# Altium schematic sheet HV_Detection.SchDoc
size A4; SheetNumber: 5; SheetTotal: 6
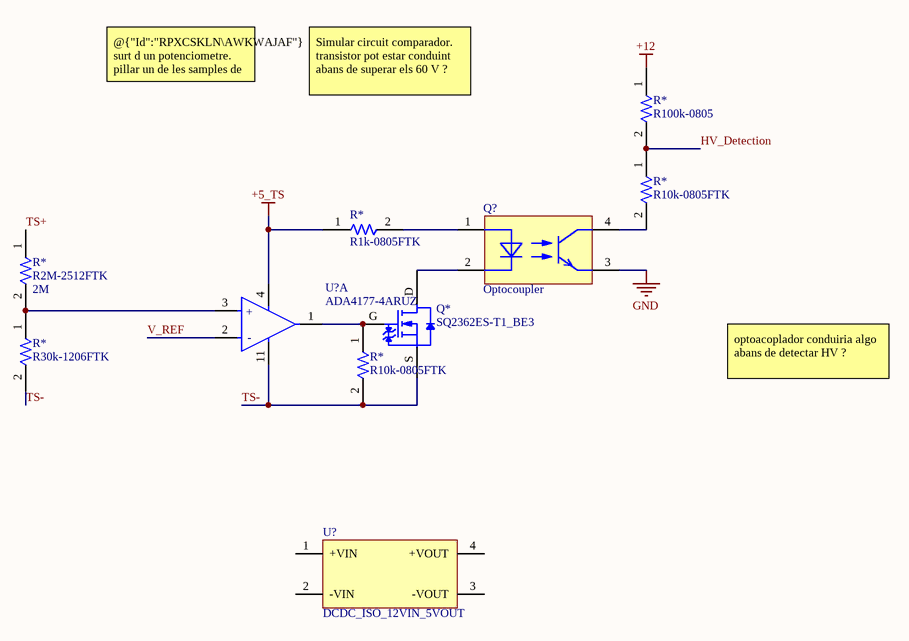
[diagram p0: HV_Detection.SchDoc]

## Parts
(Parts that share a designator on the sheet are numbered #1, #2 ... from top to bottom, then left to right.)
Q*  SQ2362ES-T1_BE3  [SOT95P245X110-3N]
Q?  Optocoupler  [WL-OCPT_LSOP4]
R*#1  R100k-0805  [RESC2013X70X40NL20T20]
R*#2  R10k-0805FTK  [R0805FTK]
R*#3  R2M-2512FTK  Resistance: 2M  [R2512FTK]
R*#4  R1k-0805FTK  [R0805FTK]
R*#5  R30k-1206FTK  [R1206FTK-W]
R*#6  R10k-0805FTK  [R0805FTK]
U?#1  ADA4177-4ARUZ  [FP-RU-14-IPC_A]  (part A of 4)
U?#2  DCDC_ISO_12VIN_5VOUT  [WPME-FISM_SIP-7_L19.65W7.05H10.16]

## Nets
+5_TS: R*#4.1 U?#1.4(V+)
+12: R*#1.1
GND: Q?.3(Emitter)
HV_Detection: R*#1.2 R*#2.1
TS+: R*#3.1
TS-: Q*.S R*#5.2 R*#6.2 U?#1.11(V-)
V_REF: U?#1.2(-IN_A)
NetQ*_D: Q*.D Q?.2(Cathode)
NetQ*_G: Q*.G R*#6.1 U?#1.1(OUT_A)
NetQ?_1: Q?.1(Anode) R*#4.2
NetQ?_4: Q?.4(Collector) R*#2.2
NetR*#3_2: R*#3.2 R*#5.1 U?#1.3(+IN_A)

Not connected (* = marked no-connect by the designer): U?#2 1(+VIN) 2(-VIN) 3(-VOUT) 4(+VOUT)

## Notes on the sheet
- @{"Id":"RPXCSKLN\AWKWAJAF"} surt d un potenciometre. pillar un de les samples de vishay
- Simular circuit comparador. transistor pot estar conduint abans de superar els 60 V ?
- optoacoplador conduiria algo abans de detectar HV ?
- (in symbol CMP-014-00003-2, part A) +; -

## Library data of the parts
Q* = CMP-013-00001-1: Small Signal Field-Effect Transistor; RoHS Compliant: Yes
Q? = CMP-00195-1: Transistor Output Optocoupler. S/N: 140100146000; RoHS Compliant: Yes
R*#1 = CMP-009-00003-2: Fixed Resistor, Metal Glaze/thick Film, 0.125W, 100000ohm, 150V, 5% +/-Tol, 200ppm/Cel, Surface Mount, 0805; Value: 100k; Power: 125mW; Max Operating Temperature: 155°C; Mounting Technology: Surface Mount; RoHS Compliant: Yes; Min Operating Temperature: -55°C; Pins: 2; Case/Package: 0805; Tolerance: 5%
R*#2 R*#6 = CMP-00085-1: BOURNS         CR0805-JW-103ELF            Surface Mount Chip Resistor, Thick Film, CR Series, 10 kohm, 125 mW,  5%, 150 V; .Creator: DR; Power Rating: 125mW; Voltage Rating (DC): 100V; Voltage Rating: 150V; Temperature Coefficient: 200ppm/°C; Value: 10k; ComponentLink6URL: https://datasheet.ciiva.com/16783/70154685-16783482.pdf?src-supplier=Allied+Electronics; Manufacturer 1: Bourns; Package Quantity: 1; ComponentLink10URL: https://datasheet.ciiva.com/7985/1856384-7985869.pdf?src-supplier=Element14; Technology: THICK FILM; Source: Passives.SchLib; RoHS Compliant: Yes; ComponentLink10Description: https://datasheet.ciiva.com/7985/1856384-7985869.pdf?src-supplier=Element14; ComponentLink1URL: https://datasheet.ciiva.com/11821/0900766b80fcdb72-11821135.pdf?src-supplier=RSComponents; ComponentLink7Description: https://datasheet.ciiva.com/5548/chpreztr-5548491.pdf?src-supplier=Mouser; Radiation Hardening: No; Design Item ID: R10k-0805FTK; ComponentLink4Description: https://datasheet.ciiva.com/7986/691949-7986187.pdf?src-supplier=Element14; Pins: 2; ComponentLink9URL: https://datasheet.ciiva.com/6559/chpreztr-6559901.pdf?src-supplier=Digi-Key; Resistor Type: Thick Film; ComponentLink4URL: https://datasheet.ciiva.com/7986/691949-7986187.pdf?src-supplier=Element14; Contact Plating: Tin; Case Code (Metric): 2012; Military Standard: Not; Depth: 1.25mm; Case/Package: 0805; Packaging: Tape and Reel; ComponentLink9Description: https://datasheet.ciiva.com/6559/chpreztr-6559901.pdf?src-supplier=Digi-Key; Construction: Rectangular; Pricing 1: 1=0,05790, 10=0,01540, 25=0,01340, 100=0,00340 (USD); ComponentLink7URL: https://datasheet.ciiva.com/5548/chpreztr-5548491.pdf?src-supplier=Mouser; Category: Chip SMD Resistors; Length: 2mm; Max Operating Temperature: 155°C; Resistance Tolerance: 5%; Manufacturer Part Number 1: CR0805-JW-103ELF; Height: 0.5mm; ComponentLink2URL: https://datasheet.ciiva.com/9122/chpreztr-9122374.pdf?src-supplier=Avnet; Thickness: 508um; Max Power Dissipation: 125mW; ComponentLink8Description: https://datasheet.ciiva.com/6559/chpreztr-6559900.pdf?src-supplier=Digi-Key; REACH SVHC: No SVHC; ComponentLink8URL: https://datasheet.ciiva.com/6559/chpreztr-6559900.pdf?src-supplier=Digi-Key; ComponentLink5URL: https://datasheet.ciiva.com/30065/159chpreztr-30065976.pdf?src-supplier=Onlinecomponents.com; Width: 1.25mm; ComponentLink11URL: https://datasheet.ciiva.com/48692/001055517-da-01-en-smd-wid-cr0805-jw-103elf-10k-ohm-1-8w-48692118.pdf?src-supplier=Conrad; ComponentLink3Description: https://datasheet.ciiva.com/22693/1902866-22693254.pdf?src-supplier=Element14; ComponentLink11Description: https://datasheet.ciiva.com/48692/001055517-da-01-en-smd-wid-cr0805-jw-103elf-10k-ohm-1-8w-48692118.pdf?src-supplier=Conrad; ComponentLink1Description: https://datasheet.ciiva.com/11821/0900766b80fcdb72-11821135.pdf?src-supplier=RSComponents; ComponentLink2Description: https://datasheet.ciiva.com/9122/chpreztr-9122374.pdf?src-supplier=Avnet; Stock 1: 57566; Min Operating Temperature: -55°C; Series: CR0805; Number of Terminations: 2; Termination: SMD/SMT; Tolerance: 5%; Mount: Surface Mount; ComponentLink6Description: https://datasheet.ciiva.com/16783/70154685-16783482.pdf?src-supplier=Allied+Electronics; ComponentLink5Description: https://datasheet.ciiva.com/30065/159chpreztr-30065976.pdf?src-supplier=Onlinecomponents.com; RoHS: Yes; Features: Moisture Resistant; ComponentLink3URL: https://datasheet.ciiva.com/22693/1902866-22693254.pdf?src-supplier=Element14
R*#3 = CMP-00108-1: Current Sense Resistors - SMD 3watts .002ohms 1%; Manufacturer: Vishay Dale; Manufacturer Part Number: WSLP25122L000FEA; Power Rating: 3W; Temperature Coefficient: 275ppm/°C; Packaging: Tape and Reel; Height: 0.635mm; Weight: 0.001429oz; Case Code (Imperial): 2512; Source: Passives.SchLib; Tolerance: 1%; Termination: SMD/SMT; RoHS: Yes; Size Code: 2512; Case Code (Metric): 6432; Stock 1: 11994; ComponentLink1URL: https://datasheet.ciiva.com/48527/wslp-48527354.pdf?src-supplier=Avnet; Package Quantity: 2000; Length: 6.4mm; Resistor Type: Metal Strip; ComponentLink1Description: https://datasheet.ciiva.com/48527/wslp-48527354.pdf?src-supplier=Avnet; Design Item ID: R2M-2512FTK; Mount: Surface Mount; Width: 3.2mm; Category: Chip SMD Resistors; RoHS Compliant: Yes; Case/Package: 2512; Max Operating Temperature: 170°C; Lead Free: Lead Free; Pricing 1: 1=1,07000, 10=1,07000, 50=1,07000, 100=1,07000, 1000=0,77100, 10000=0,75500 (USD); Series: WSLP; Min Operating Temperature: -65°C
R*#4 = CMP-00076-1: Res Thick Film 0805 1K Ohm 5% 1/8W ±200ppm/°C Molded SMD SMD Paper Tape on Plastic Reel; Manufacturer Part Number 1: CR0805-JW-102ELF; Manufacturer 1: Bourns; Voltage Rating (DC): 150V; Power Rating: 125mW; .Creator: GP; Number of Terminations: 2; REACH SVHC: No SVHC; ComponentLink3URL: https://datasheet.ciiva.com/22693/1902866-22693253.pdf?src-supplier=Element14; ComponentLink1URL: https://datasheet.ciiva.com/11821/0900766b80fcdb72-11821134.pdf?src-supplier=RSComponents; ComponentLink1Description: https://datasheet.ciiva.com/11821/0900766b80fcdb72-11821134.pdf?src-supplier=RSComponents; Category: Chip SMD Resistors; Stock 1: 27510; Case/Package: 0805; ComponentLink3Description: https://datasheet.ciiva.com/22693/1902866-22693253.pdf?src-supplier=Element14; Length: 2mm; ComponentLink5URL: https://datasheet.ciiva.com/7985/1856384-7985867.pdf?src-supplier=Element14; ComponentLink7Description: https://datasheet.ciiva.com/6547/chpreztr-6547359.pdf?src-supplier=Digi-Key; Package Quantity: 1; Tolerance: 5%; Lead Free: Lead Free; RoHS: Yes; Contact Plating: Tin; ComponentLink2Description: https://datasheet.ciiva.com/15225/getdatasheetpartid-78155-15225381.pdf?src-supplier=Verical; ComponentLink5Description: https://datasheet.ciiva.com/7985/1856384-7985867.pdf?src-supplier=Element14; Depth: 1.25mm; Thickness: 508um; Resistor Type: Thick Film; Design Item ID: R1k-0805FTK; ComponentLink2URL: https://datasheet.ciiva.com/15225/getdatasheetpartid-78155-15225381.pdf?src-supplier=Verical; Max Operating Temperature: 155°C; ComponentLink6URL: https://datasheet.ciiva.com/30242/159chpreztr-30242765.pdf?src-supplier=Onlinecomponents.com; ComponentLink4URL: https://datasheet.ciiva.com/7986/1856384-7986184.pdf?src-supplier=Element14; Military Standard: Not; Case Code (Metric): 2012; Temperature Coefficient: 200ppm/°C; Pricing 1: 1=0,05930, 10=0,03510, 25=0,01790, 100=0,00800, 250=0,00790, 500=0,00590, 1000=0,00360, 3000=0,00350, 6000=0,00250 (USD); Min Operating Temperature: -55°C; ComponentLink7URL: https://datasheet.ciiva.com/6547/chpreztr-6547359.pdf?src-supplier=Digi-Key; Width: 1.25mm; Source: Passives.SchLib; Max Power Dissipation: 125mW; Voltage Rating: 150V; ComponentLink4Description: https://datasheet.ciiva.com/7986/1856384-7986184.pdf?src-supplier=Element14; Features: Moisture Resistant; Mount: Surface Mount; Termination: SMD/SMT; Value: 1k; Height: 0.5mm; Radiation Hardening: No; ComponentLink6Description: https://datasheet.ciiva.com/30242/159chpreztr-30242765.pdf?src-supplier=Onlinecomponents.com; Pins: 2; Packaging: Tape and Reel
R*#5 = CMP-00092-1: Res Thick Film 1206 30K Ohm 1% 1/4W ±100ppm/°C Molded SMD SMD Paper T/R; Manufacturer: Vishay; Manufacturer Part Number: CRCW120630K0FKEA; Max Power Dissipation: 250mW; Voltage Rating: 200V; .Creator: GP; Military Standard: Not; Min Operating Temperature: -55°C; Tolerance: 1%; Category: Resistor; Pins: 2; Resistor Type: Thick Film; Height: 0.55mm; Resistance Tolerance: 1%; ComponentLink2URL: https://es.rs-online.com/web/p/resistencias-de-montaje-en-superficie/6792039; Series: CRCW; ComponentLink1URL: https://docs.rs-online.com/bca8/A700000006404581.pdf; Termination: SMD/SMT; Radiation Hardening: No; Case/Package: 1206; Max Operating Temperature: 155°C; Case Code (Metric): 3216; RoHS: Yes; Power Rating: 250mW; Pricing 1: 50=0,12000, 500=0,11200, 1000=0,10400, 2000=0,09700, 4000=0,08900 (USD); Stock 1: 3550; ComponentLink2Description: Where buy it; Construction: Rectangular; Packaging: Tape and Reel; ComponentLink1Description: Datasheet; RoHS Compliant: Yes; Temperature Coefficient: 100ppm/°C; Size Code: 1206; Package Quantity: 10; Number of Terminations: 2; Value: 30k; REACH SVHC: Unknown; Technology: THICK FILM; Length: 3.2mm; Contact Plating: Tin; Depth: 1.6mm; Features: Automotive AEC-Q200; Source: Passives.SchLib; Design Item ID: R30k-1206FTK; Width: 1.6mm; Weight: 0.000353oz
U?#1 = CMP-014-00003-2: Operational Amplifier, 4 Func, 300uV Offset-Max, BIPolar, PDSO14; Nominal Supply Voltage: 5V; Channels: 4; RoHS Compliant: Yes; Min Operating Temperature: -40°C; Max Operating Temperature: 125°C; Pins: 14; Case/Package: TSSOP
U?#2 = CMP-019-00001-1: WPME-FISM Fixed Isolated SIP/SMT Module